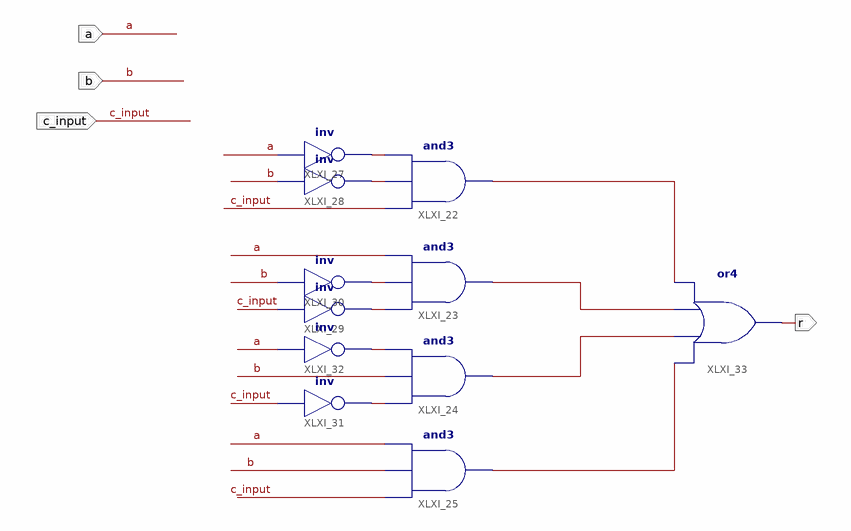
[diagram p0: schematic sheet 1]
// Xilinx ISE schematic add1b.sch (spartan3e) as structural Verilog: 11 symbols, 4 ports
module add1b (
  input  a,
  input  b,
  input  c_input,
  output r
);

  wire XLXN_11, XLXN_12, XLXN_13, XLXN_14, XLXN_16, XLXN_17, XLXN_18, XLXN_20, XLXN_50, XLXN_55;

  and XLXI_22 (XLXN_16, c_input, XLXN_11, XLXN_50);
  and XLXI_23 (XLXN_17, XLXN_12, XLXN_13, a);
  and XLXI_24 (XLXN_18, XLXN_14, b, XLXN_55);
  and XLXI_25 (XLXN_20, c_input, b, a);
  not XLXI_28 (XLXN_11, b);
  not XLXI_29 (XLXN_12, c_input);
  not XLXI_30 (XLXN_13, b);
  not XLXI_31 (XLXN_14, c_input);
  not XLXI_32 (XLXN_55, a);
  or XLXI_33 (r, XLXN_20, XLXN_18, XLXN_17, XLXN_16);
  not XLXI_27 (XLXN_50, a);
endmodule
